# EAGLE design LCD-OLinuXino-15_6_revision_D (EAGLE 4.16)
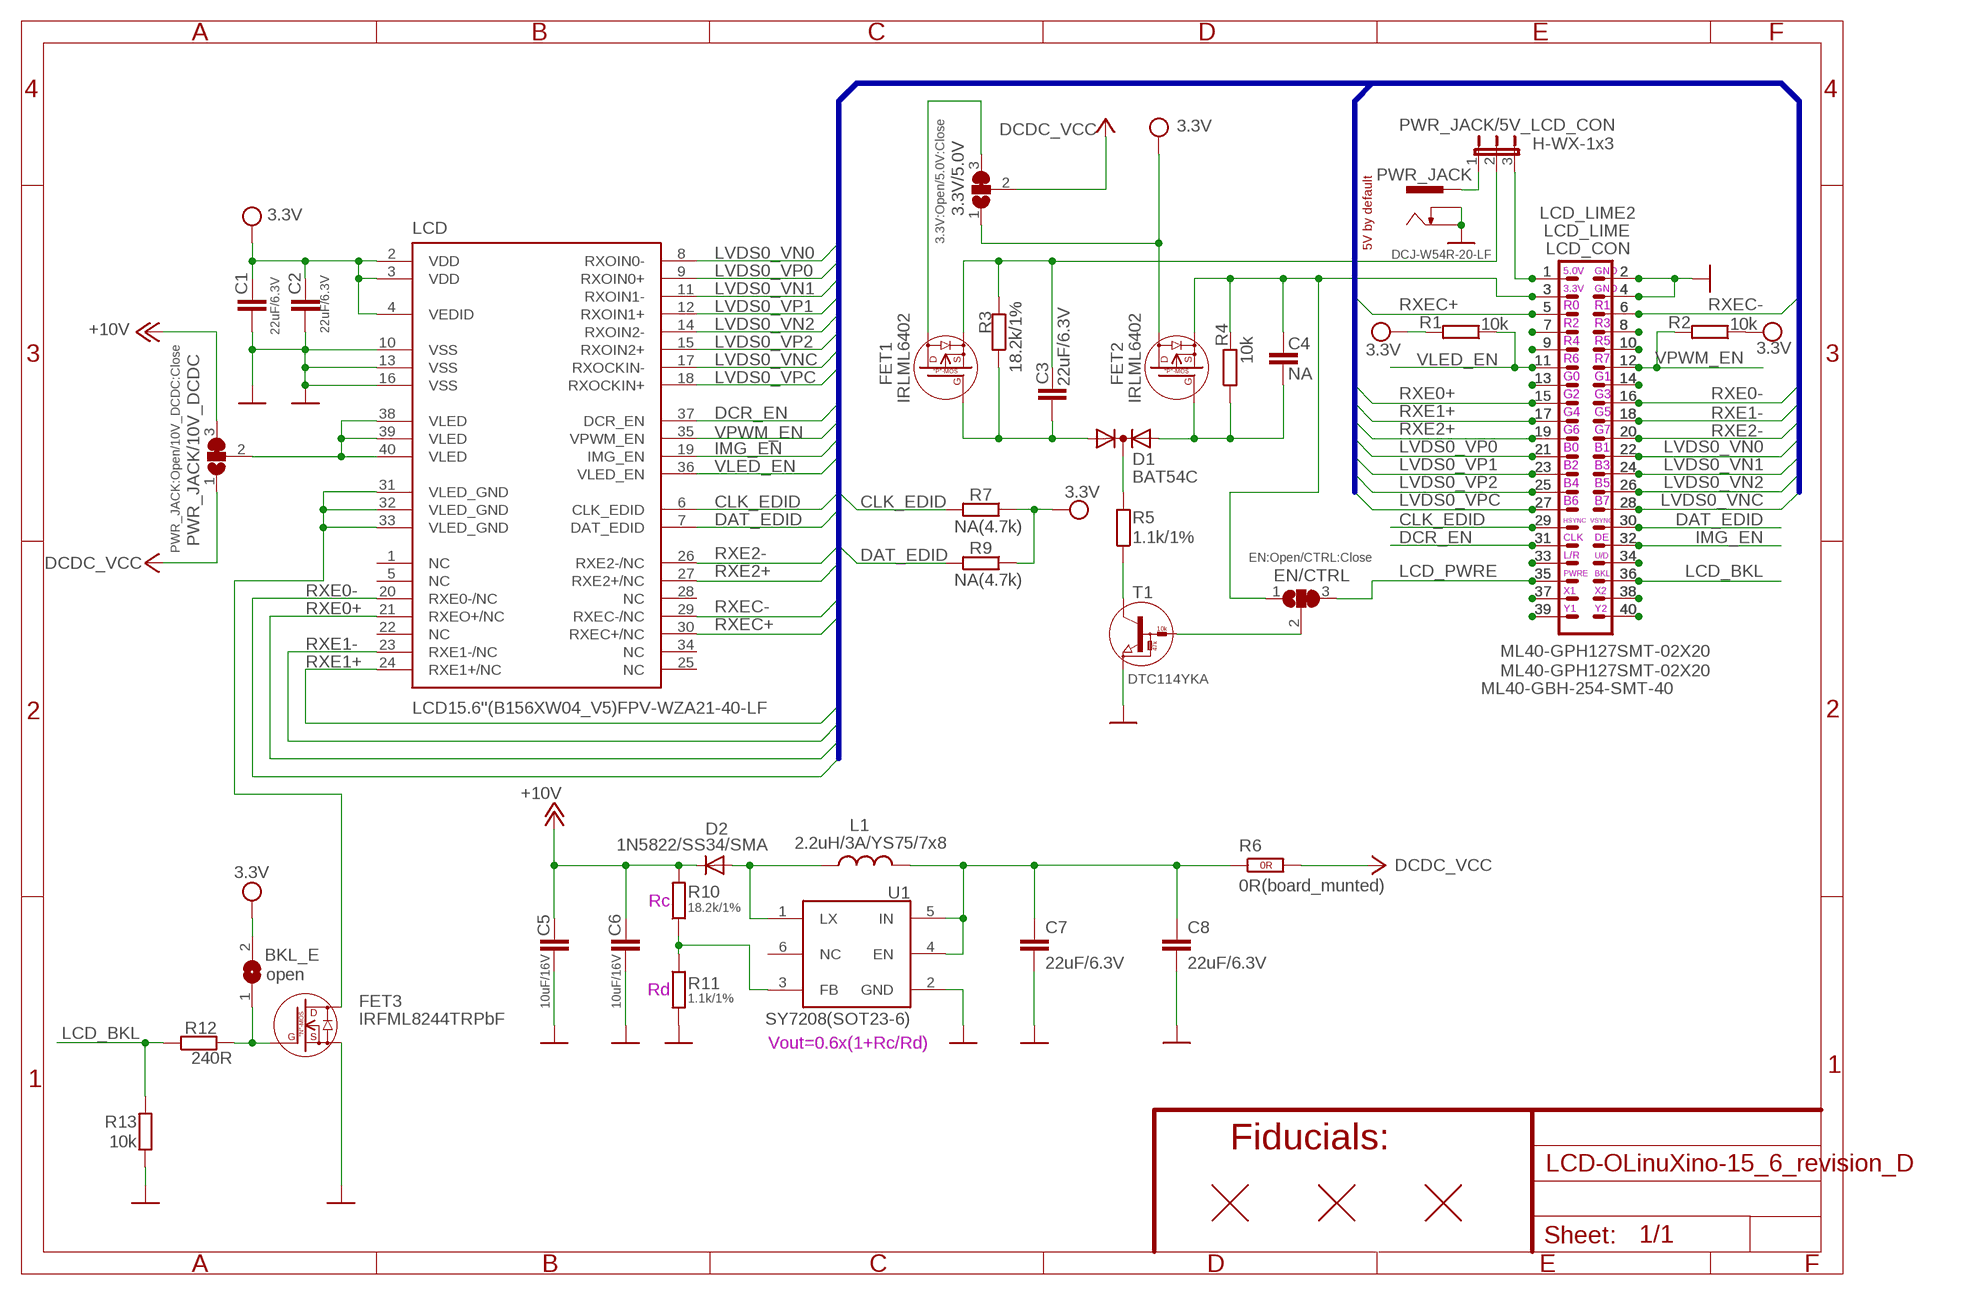
[diagram p0: schematic, sheet 1]

## Parts
3.3V/5.0V  3.3V:Open/5.0V:Close  SJ2W5  [SJ_2_SMALL_23_TIED]
BKL_E  open  SJSJ_1_THE_SMALLEST  [SJ_1_THE_SMALLEST]
C1  22uF/6.3V  C-EUC0603_DWS  [C0603_DWS]
C2  22uF/6.3V  C-EUC0603_DWS  [C0603_DWS]
C3  22uF/6.3V  C-EUC0805_5MIL_DWS  [C0805_5MIL_DWS]
C4  NA  C-EUC0603_DWS  [C0603_DWS]
C5  10uF/16V  C-EUC0805_5MIL_DWS  [C0805_5MIL_DWS]
C6  10uF/16V  C-EUC0805_5MIL_DWS  [C0805_5MIL_DWS]
C7  22uF/6.3V  C-EUC0805_5MIL_DWS  [C0805_5MIL_DWS]
C8  22uF/6.3V  C-EUC0805_5MIL_DWS  [C0805_5MIL_DWS]
D1  BAT54C  DIODE_AC-CA_  [SOT23C]
D2  1N5822/SS34/SMA  D-MLL-41  [MELF-MLL41]
EN/CTRL  EN:Open/CTRL:Close  SJ2W5  [SJ_2_SMALL_23_TIED]
FET1  IRLML6402  P-MOS+DIODIRLML6402  [SOT23]
FET2  IRLML6402  P-MOS+DIODIRLML6402  [SOT23]
FET3  IRFML8244TRPbF  N-MOS+DIODBSS138(SOT23-3)  [SOT23]
L1  2.2uH/3A/YS75/7x8  LLQH88PN100M38  [8X8MM_3131]
LCD  LCD15.6''(B156XW04_V5)FPV-WZA21-40-LF  [LCD_15.6'']
LCD_CON  ML40-GBH-254-SMT-40  [ML40-MALE(GBH-254-SMT-40)]
LCD_LIME  ML40-GPH127SMT-02X20  ML40YA-V36P-2X20-LF  [YA-V36P-2X20-LF]
LCD_LIME2  ML40-GPH127SMT-02X20  ML40-GPH127SMT-02X20(PA-V16X-2X20-LF)  [GPH127SMT-02X20(PA-V16X-2X20-LF)]
PWR_JACK  DCJ-W54R-20-LF  PWR-JAKDCJ-W  [PWR-JACK-SMD]
PWR_JACK/5V_LCD_CON  H-WX-1x3  JP2EHN1X3-SMD  [HN1X3-SMD]
PWR_JACK/10V_DCDC  PWR_JACK:Open/10V_DCDC:Close  SJ2W3  [SJ_2_SMALL]
R1  10k  R-EU_R0603_5MIL_DWS  [R0603_5MIL_DWS]
R2  10k  R-EU_R0603_5MIL_DWS  [R0603_5MIL_DWS]
R3  18.2k/1%  R-EU_R0603_5MIL_DWS  [R0603_5MIL_DWS]
R4  10k  R-EU_R0603_5MIL_DWS  [R0603_5MIL_DWS]
R5  1.1k/1%  R-EU_R0603_5MIL_DWS  [R0603_5MIL_DWS]
R6  0R(board_munted)  R_0R0R(NA)  [0603_0R]
R7  NA(4.7k)  R-EU_R0603_5MIL_DWS  [R0603_5MIL_DWS]
R9  NA(4.7k)  R-EU_R0603_5MIL_DWS  [R0603_5MIL_DWS]
R10  18.2k/1%  R-EU_R0603_5MIL_DWS  [R0603_5MIL_DWS]
R11  1.1k/1%  R-EU_R0603_5MIL_DWS  [R0603_5MIL_DWS]
R12  240R  R-EU_R0603_5MIL_DWS  [R0603_5MIL_DWS]
R13  10k  R-EU_R0603_5MIL_DWS  [R0603_5MIL_DWS]
T1  DTC114YKA  DIGITAL_TRANSISTORS-NPNDTC114YKA  [SOT-23]
U1  SY7208(SOT23-6)  SY7208  [SOT23-6]
U$1  FIDUCIAL  [FIDUCIAL-1X3]
U$2  FIDUCIAL  [FIDUCIAL-1X3]
U$3  FIDUCIAL  [FIDUCIAL-1X3]

## Nets
3.3VDC [pwr]: C4.1 EN/CTRL.1 FET2.2(S) LCD_CON.3 LCD_LIME2.3 LCD_LIME.3 R4.2
5VDC: C3.1 FET1.2(S) PWR_JACK/5V_LCD_CON.2 R3.2
+5V: 3.3V/5.0V.2 PWR_JACK/10V_DCDC.1 R6.2(1.2) ; supply symbol labelled DCDC_VCC
+12V [pwr]: C5.1 C6.1 D2.1(C) PWR_JACK/10V_DCDC.3 R10.2 ; supply symbol labelled +10V
CLK_EDID: LCD.6(CLK_EDID) LCD_CON.29 LCD_LIME2.29 LCD_LIME.29 R7.2
DAT_EDID: LCD.7(DAT_EDID) LCD_CON.30 LCD_LIME2.30 LCD_LIME.30 R9.2
DCR_EN: LCD.37(DCR_EN) LCD_CON.31 LCD_LIME2.31 LCD_LIME.31
GND [pwr]: C1.2 C2.2 C5.2 C6.2 C7.2 C8.2 FET3.2(S) LCD.10(VSS) LCD.13(VSS) LCD.16(VSS) LCD_CON.2 LCD_CON.4 LCD_LIME2.2 LCD_LIME2.4 LCD_LIME.2 LCD_LIME.4 PWR_JACK.2(-) PWR_JACK.3(--) R11.2 R13.1 T1.2(E) U1.2(GND)
IMG_EN: LCD.19(IMG_EN) LCD_CON.32 LCD_LIME2.32 LCD_LIME.32
LCD_BKL: LCD_CON.36 LCD_LIME2.36 LCD_LIME.36 R12.1 R13.2
LCD_PWRE: EN/CTRL.3 LCD_CON.35 LCD_LIME2.35 LCD_LIME.35
LVDS0_VN0: LCD.8(RXOIN0-) LCD_CON.22 LCD_LIME2.22 LCD_LIME.22
LVDS0_VN1: LCD.11(RXOIN1-) LCD_CON.24 LCD_LIME2.24 LCD_LIME.24
LVDS0_VN2: LCD.14(RXOIN2-) LCD_CON.26 LCD_LIME2.26 LCD_LIME.26
LVDS0_VNC: LCD.17(RXOCKIN-) LCD_CON.28 LCD_LIME2.28 LCD_LIME.28
LVDS0_VP0: LCD.9(RXOIN0+) LCD_CON.21 LCD_LIME2.21 LCD_LIME.21
LVDS0_VP1: LCD.12(RXOIN1+) LCD_CON.23 LCD_LIME2.23 LCD_LIME.23
LVDS0_VP2: LCD.15(RXOIN2+) LCD_CON.25 LCD_LIME2.25 LCD_LIME.25
LVDS0_VPC: LCD.18(RXOCKIN+) LCD_CON.27 LCD_LIME2.27 LCD_LIME.27
N$1: 3.3V/5.0V.3 FET1.3(D)
N$2 [pwr]: FET3.3(D) LCD.31(VLED_GND) LCD.32(VLED_GND) LCD.33(VLED_GND)
N$3 [pwr]: LCD.38(VLED) LCD.39(VLED) LCD.40(VLED) PWR_JACK/10V_DCDC.2
N$4: BKL_E.1 FET3.1(G) R12.2
N$5: LCD_CON.7 LCD_LIME2.7 LCD_LIME.7
N$6: LCD_CON.9 LCD_LIME2.9 LCD_LIME.9
N$7: LCD_CON.13 LCD_LIME2.13 LCD_LIME.13
N$8: C4.2 D1.1(A1) FET2.1(G) R4.1
N$9: C3.2 D1.2(A2) FET1.1(G) R3.1
N$10: LCD_CON.33 LCD_LIME2.33 LCD_LIME.33
N$11: R5.1 T1.3(C)
N$12: LCD_CON.37 LCD_LIME2.37 LCD_LIME.37
N$13: LCD_CON.39 LCD_LIME2.39 LCD_LIME.39
N$14: LCD_CON.8 LCD_LIME2.8 LCD_LIME.8
N$15: LCD_CON.10 LCD_LIME2.10 LCD_LIME.10
N$16: EN/CTRL.2 T1.1(B)
N$17: LCD_CON.14 LCD_LIME2.14 LCD_LIME.14
N$18: LCD_CON.34 LCD_LIME2.34 LCD_LIME.34
N$19: D1.3(K) R5.2
N$20: LCD_CON.1 LCD_LIME2.1 LCD_LIME.1 PWR_JACK/5V_LCD_CON.3
N$21: LCD_CON.38 LCD_LIME2.38 LCD_LIME.38
N$22 [pwr]: PWR_JACK.1(+) PWR_JACK/5V_LCD_CON.1
N$23: LCD_CON.40 LCD_LIME2.40 LCD_LIME.40
N$24: C7.1 C8.1 L1.2 R6.1(1.1) U1.4(EN) U1.5(IN)
N$123: D2.2(A) L1.1 U1.1(LX)
N$126: R10.1 R11.1 U1.3(FB)
RXE0+: LCD.21(RXEO+/NC) LCD_CON.15 LCD_LIME2.15 LCD_LIME.15
RXE0-: LCD.20(RXE0-/NC) LCD_CON.16 LCD_LIME2.16 LCD_LIME.16
RXE1+: LCD.24(RXE1+/NC) LCD_CON.17 LCD_LIME2.17 LCD_LIME.17
RXE1-: LCD.23(RXE1-/NC) LCD_CON.18 LCD_LIME2.18 LCD_LIME.18
RXE2+: LCD.27(RXE2+/NC) LCD_CON.19 LCD_LIME2.19 LCD_LIME.19
RXE2-: LCD.26(RXE2-/NC) LCD_CON.20 LCD_LIME2.20 LCD_LIME.20
RXEC+: LCD.30(RXEC+/NC) LCD_CON.5 LCD_LIME2.5 LCD_LIME.5
RXEC-: LCD.29(RXEC-/NC) LCD_CON.6 LCD_LIME2.6 LCD_LIME.6
VCC [pwr]: 3.3V/5.0V.1 BKL_E.2 C1.1 C2.1 FET2.3(D) LCD.2(VDD) LCD.3(VDD) LCD.4(VEDID) R1.2 R2.1 R7.1 R9.1 ; supply symbol labelled 3.3V
VLED_EN: LCD.36(VLED_EN) LCD_CON.11 LCD_LIME2.11 LCD_LIME.11 R1.1
VPWM_EN: LCD.35(VPWM_EN) LCD_CON.12 LCD_LIME2.12 LCD_LIME.12 R2.2
Unconnected: LCD.1(NC) LCD.5(NC) LCD.22(NC) LCD.25(NC) LCD.28(NC) LCD.34(NC) U1.6(NC)

## Buses
LVDS0_VP[0..2],LVDS0_VN[0..2],LVDS0_VPC,LVDS0_VNC,CLK_EDID,DAT_EDID,DCR_EN,IMG_EN,VPWM_EN,VLED_EN,RXE0-,RXE0+,RXE1-,RXE1+,RXE2-,RXE2+,RXEC-,RXEC+

## Notes on the sheet
- 5V by default
- 5.0V | GND
- 3.3V | GND
- R0 | R1
- R2 | R3
- R4 | R5
- R6 | R7
- G0 | G1
- G2 | G3
- G4 | G5
- G6 | G7
- B0 | B1
- B2 | B3
- B4 | B5
- B6 | B7
- HSYNC | VSYNC
- CLK | DE
- L/R | U/D
- PWRE | BKL
- X1 | X2
- Y1 | Y2
- Rc
- Rd
- Vout=0.6x(1+Rc/Rd)
- Fiducials:

## Library data of the parts
3.3V/5.0V EN/CTRL PWR_JACK/10V_DCDC = jumper:SJ2W: SMD solder JUMPER
BKL_E = jumper:SJ: SMD solder JUMPER
C1-C8 = rcl:C-EU: CAPACITOR, European symbol
D1 = semicon-smd-ipc:DIODE_AC-CA_: DUAL DIODE
D2 = semicon-smd-ipc:D-: DIODE unfilled
FET1 FET2 = Penko:P-MOS+DIOD
FET3 = Penko:N-MOS+DIOD
L1 = OLIMEX_DISCRET:L
LCD = olimex_lcd:LCD15.6''(B156XW04_V5): LCD B156XW04 V5 LCD type: Color Active Matrix Liquid Cristal Display composed of a TFT LCD panel, a driver circuit, and LED backlight system Screen format: 16x9 HD(1366x768 pixels) Number of colors: 262K colors(RGB 6-bits data driver) Pixel Pitch: 0.252x0.252mm Pixel Format: RGB Vertical Stripe Display Mode: Normally White White Luminance (Iled=20mA): 200cd/m2 typical, 170cd/m2 minimum Response Time: 8ms Nominal Input Voltage VDD: +3.3V Power Consumption: 3.4W Physical size: 360x224.3x3.8 Electrical interface: 1 channel LVDS
LCD_CON LCD_LIME LCD_LIME2 = con-harting-ml:ML40: HARTING
PWR_JACK = gogo:PWR-JAK
PWR_JACK/5V_LCD_CON = jumper:JP2E: JUMPER
R1-R5 R7 R9-R13 = rcl:R-EU_: RESISTOR, European symbol
R6 = OLIMEX_DISCRET:R_0R
T1 = OLIMEX_DISCRET:DIGITAL_TRANSISTORS-NPN: DTC114YKA Digital Transistor - NPN
U1 = OLIMEX_IC:SY7208
U$1-U$3 = SparkFunEagle-6-6-07:FIDUCIAL: Fiducial Alignment Points Various fiducial points for machine vision alignment.

## Net classes
1 pwr: width 0.254 mm, drill 0.241 mm, clearance 0.254 mm

## Board
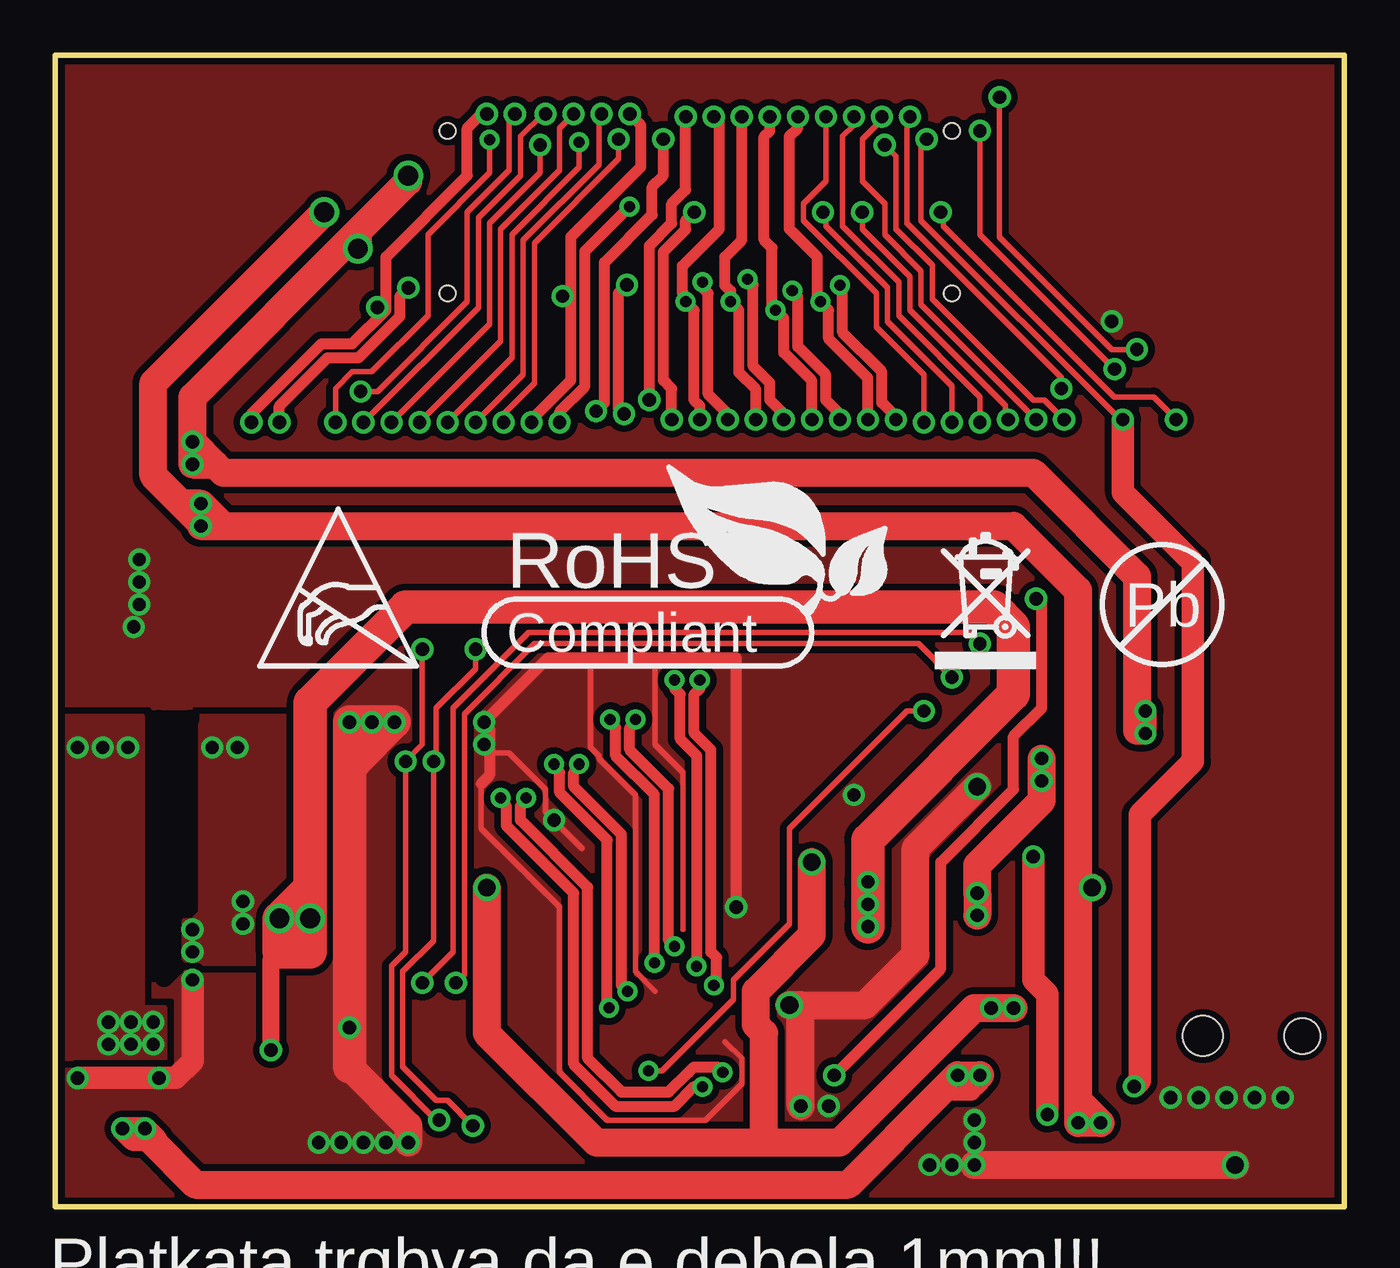
[diagram p1: board, top side]
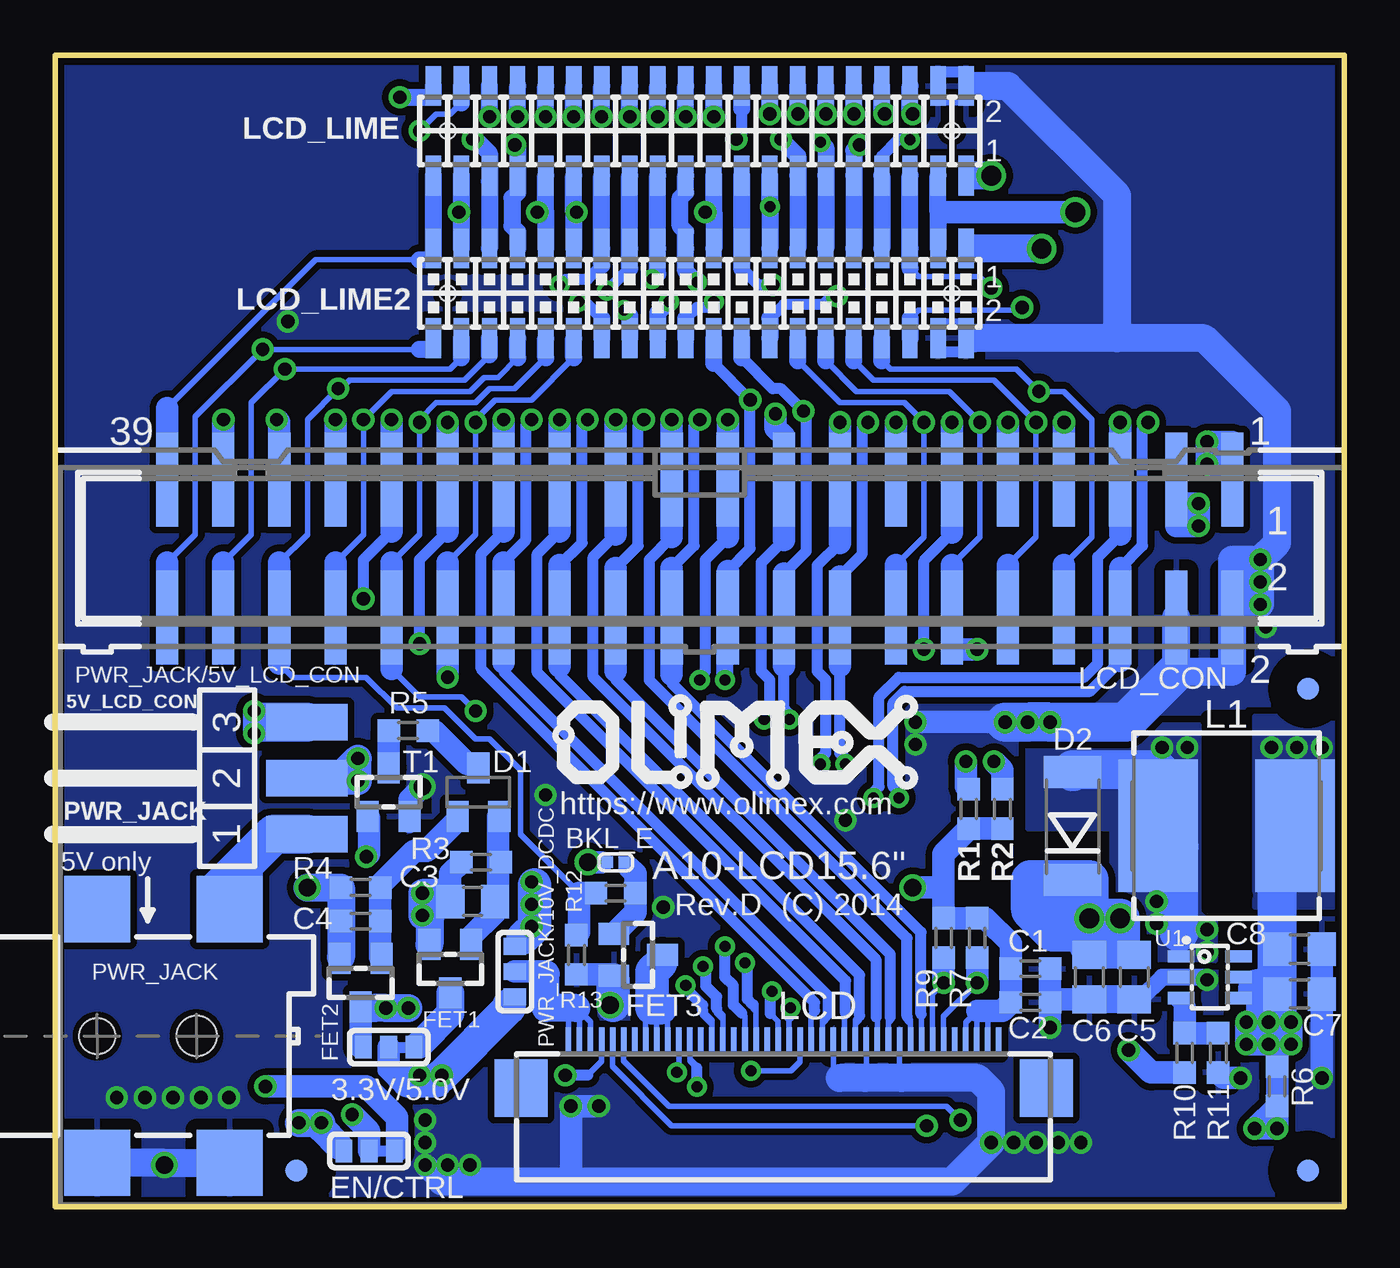
[diagram p2: board, bottom side, seen from below]

Size 58.42 x 52.2 mm. Coordinates in mm from the lower left corner, seen from the top.
Outline: 0,52.2 0,0 58.42,0 58.42,52.2 0,52.2
Copper layers (1+16): Top 0.035mm / dielectric 1mm / Bottom 0.035mm
Design rules "default": minimum track width 9.5mil, minimum drill 0.5mm, track to track 5mil, track to pad 8mil, pad to pad 8mil, via to via 8mil, smd to smd 1mil, copper to edge 10mil, drill to drill 8mil, minimum pad ring 8mil, minimum via ring 8mil, stop-mask expansion 4mil, vias tented up to drill 40mil, thermal gap 20mil
tRestrict: 3 lines
bRestrict: 2 lines

### Footprints (pad centres in the part's own frame; a part is rotated, then mirrored left to right if it is on the bottom)
SJ_2_SMALL_23_TIED = smd 0.762 x 1.016: 1 -1.143,0; 2 0,0; 3 1.143,0
SJ_1_THE_SMALLEST = smd 0.508 x 0.508: 1 -0.381,0; 2 0.381,0
C0603_DWS = smd 1.016 x 1.016: 1 -0.889,0; 2 0.889,0
C0805_5MIL_DWS = smd 1.27 x 1.524: 1 -1.016,0; 2 1.016,0
SOT23C = smd 1 x 1.4: 1 -0.95,-1.1; 2 0.95,-1.1; 3 0,1.1
MELF-MLL41 = smd 1.45 x 2.6: 1 -2.445,0; 2 2.445,0
SOT23 = smd 1 x 1.4: 1 -0.95,-1.1; 2 0.95,-1.1; 3 0,1.1
8X8MM_3131 = smd 3.6 x 6: 1 -3.1,0; 2 3.1,0
LCD_15.6'' = smd 0.25 x 1.3 bottom: 1 -67.54,31.89; 2 -67.04,31.89; 3 -66.54,31.89; 4 -66.04,31.89; 5 -65.54,31.89; 6 -65.04,31.89; 7 -64.54,31.89; 8 -64.04,31.89; 9 -63.54,31.89; 10 -63.04,31.89; 11 -62.54,31.89; 12 -62.04,31.89; 13 -61.54,31.89; 14 -61.04,31.89; 15 -60.54,31.89; 16 -60.04,31.89; 17 -59.54,31.89; 18 -59.04,31.89; 19 -58.54,31.89; 20 -58.04,31.89; 21 -57.54,31.89; 22 -57.04,31.89; 23 -56.54,31.89; 24 -56.04,31.89; 25 -55.54,31.89; 26 -55.04,31.89; 27 -54.54,31.89; 28 -54.04,31.89; 29 -53.54,31.89; 30 -53.04,31.89; 31 -52.54,31.89; 32 -52.04,31.89; 33 -51.54,31.89; 34 -51.04,31.89; 35 -50.54,31.89; 36 -50.04,31.89; 37 -49.54,31.89; 38 -49.04,31.89; 39 -48.54,31.89; 40 -48.04,31.89 | smd 2.4 x 2.6 bottom: P1 -69.69,29.79; P2 -45.89,29.79
ML40-MALE(GBH-254-SMT-40) = smd 1 x 4.25: 1 -24.13,-3.125; 2 -24.13,3.125; 3 -21.59,-3.125; 4 -21.59,3.125; 5 -19.05,-3.125; 6 -19.05,3.125; 7 -16.51,-3.125; 8 -16.51,3.125; 9 -13.97,-3.125; 10 -13.97,3.125; 11 -11.43,-3.125; 12 -11.43,3.125; 13 -8.89,-3.125; 14 -8.89,3.125; 15 -6.35,-3.125; 16 -6.35,3.125; 17 -3.81,-3.125; 18 -3.81,3.125; 19 -1.27,-3.125; 20 -1.27,3.125; 21 1.27,-3.125; 22 1.27,3.125; 23 3.81,-3.125; 24 3.81,3.125; 25 6.35,-3.125; 26 6.35,3.125; 27 8.89,-3.125; 28 8.89,3.125; 29 11.43,-3.125; 30 11.43,3.125; 31 13.97,-3.125; 32 13.97,3.125; 33 16.51,-3.125; 34 16.51,3.125; 35 19.05,-3.125; 36 19.05,3.125; 37 21.59,-3.125; 38 21.59,3.125; 39 24.13,-3.125; 40 24.13,3.125
YA-V36P-2X20-LF = smd 0.7 x 1.8: 1 -12.065,2.032; 2 -12.065,-2.032; 3 -10.795,2.032; 4 -10.795,-2.032; 5 -9.525,2.032; 6 -9.525,-2.032; 7 -8.255,2.032; 8 -8.255,-2.032; 9 -6.985,2.032; 10 -6.985,-2.032; 11 -5.715,2.032; 12 -5.715,-2.032; 13 -4.445,2.032; 14 -4.445,-2.032; 15 -3.175,2.032; 16 -3.175,-2.032; 17 -1.905,2.032; 18 -1.905,-2.032; 19 -0.635,2.032; 20 -0.635,-2.032; 21 0.635,2.032; 22 0.635,-2.032; 23 1.905,2.032; 24 1.905,-2.032; 25 3.175,2.032; 26 3.175,-2.032; 27 4.445,2.032; 28 4.445,-2.032; 29 5.715,2.032; 30 5.715,-2.032; 31 6.985,2.032; 32 6.985,-2.032; 33 8.255,2.032; 34 8.255,-2.032; 35 9.525,2.032; 36 9.525,-2.032; 37 10.795,2.032; 38 10.795,-2.032; 39 12.065,2.032; 40 12.065,-2.032 | hole 0.7: -11.43,0; 11.43,0
GPH127SMT-02X20(PA-V16X-2X20-LF) = smd 0.7 x 1.8: 1 -12.065,-2.032; 2 -12.065,2.032; 3 -10.795,-2.032; 4 -10.795,2.032; 5 -9.525,-2.032; 6 -9.525,2.032; 7 -8.255,-2.032; 8 -8.255,2.032; 9 -6.985,-2.032; 10 -6.985,2.032; 11 -5.715,-2.032; 12 -5.715,2.032; 13 -4.445,-2.032; 14 -4.445,2.032; 15 -3.175,-2.032; 16 -3.175,2.032; 17 -1.905,-2.032; 18 -1.905,2.032; 19 -0.635,-2.032; 20 -0.635,2.032; 21 0.635,-2.032; 22 0.635,2.032; 23 1.905,-2.032; 24 1.905,2.032; 25 3.175,-2.032; 26 3.175,2.032; 27 4.445,-2.032; 28 4.445,2.032; 29 5.715,-2.032; 30 5.715,2.032; 31 6.985,-2.032; 32 6.985,2.032; 33 8.255,-2.032; 34 8.255,2.032; 35 9.525,-2.032; 36 9.525,2.032; 37 10.795,-2.032; 38 10.795,2.032; 39 12.065,-2.032; 40 12.065,2.032 | hole 0.7: -11.43,0; 11.43,0
PWR-JACK-SMD = smd 3 x 3: 1 6,5.75; 2 0,-5.75; 3 6,-5.75; 4 0,5.75 | hole 1.6: 0,0 | hole 1.8: 4.5,0
HN1X3-SMD = smd 1.651 x 3.683: 1 -2.54,-0.229; 2 0,-0.229; 3 2.54,-0.229
SJ_2_SMALL = smd 0.762 x 1.016: 1 -1.143,0; 2 0,0; 3 1.143,0
R0603_5MIL_DWS = smd 1.016 x 1.016: 1 -0.889,0; 2 0.889,0
0603_0R = smd 1.016 x 1.016: 1 -0.889,0; 2 0.889,0
SOT-23 = smd 1 x 1.4: 1 -0.95,-1.1; 2 0.95,-1.1; 3 0,1.1
SOT23-6 = smd 0.55 x 1.2: 1 -0.95,-1.3; 2 0,-1.3; 3 0.95,-1.3; 4 0.95,1.3; 5 0,1.3; 6 -0.95,1.3
FIDUCIAL-1X3 = smd 1 x 1: 1 0,0

### Placement (x,y rotation side)
3.3V/5.0V  43.31,7.24 0 bottom
BKL_E  33.02,15.62 180 bottom
C1  14.22,10.79 0 bottom
C2  14.22,9.27 0 bottom
C3  39.5,13.84 0 bottom
C4  44.58,12.95 0 bottom
C5  9.53,10.41 270 bottom
C6  11.56,10.41 270 bottom
C7  2.03,9.65 0 bottom
C8  2.03,11.68 0 bottom
D1  39.24,18.8 0 bottom
D2  12.32,17.27 90 bottom
EN/CTRL  44.2,2.54 0 bottom
FET1  40.51,10.79 180 bottom
FET2  44.58,10.16 180 bottom
FET3  32,11.43 270 bottom
L1  5.33,17.27 0 bottom
LCD  83.2,-24.4 0 top
LCD_CON  29.21,29.84 180 bottom
LCD_LIME  29.21,48.77 180 bottom
LCD_LIME2  29.21,41.4 180 bottom
PWR_JACK  56.52,7.75 0 bottom
PWR_JACK/5V_LCD_CON  47.24,19.43 90 bottom
PWR_JACK/10V_DCDC  37.59,10.67 90 bottom
R1  17.02,18.03 270 bottom
R2  15.49,18.03 90 bottom
R3  39.12,15.62 180 bottom
R4  44.58,14.48 180 bottom
R5  42.42,21.59 0 bottom
R6  3.05,5.46 270 bottom
R7  16.64,12.19 270 bottom
R9  18.16,12.19 270 bottom
R10  7.24,6.99 270 bottom
R11  5.71,6.99 270 bottom
R12  33.02,14.22 0 bottom
R13  34.8,11.43 90 bottom
T1  43.31,18.8 0 bottom
U1  6.1,10.41 270 bottom
U$1  47.5,1.65 270 bottom
U$2  1.65,1.65 270 bottom
U$3  1.65,23.5 270 bottom
U$5  [ROHS]  20.45,25.15 0 top
U$6  [PB]  50.16,27.3 0 top
U$8  [OLIMEX1_V]  18.16,18.8 0 bottom
U$10  [ESD_SYMBOL]  9.27,24.51 0 top
U$11  [RECYCLE_BIN1/8]  39.88,24.38 0 top

### Tracks (layer width: path | path; a pad name or v marks a point on that pad's centre or on a via)
3.3VDC  (via drill 0.6, 0.8, 0.9)
  Top 1.27: 7.62,30.86 v6.6,31.88 | v6.6,30.86 7.62,30.86 | v6.6,30.86 v6.6,31.88 | 7.62,30.86 43.43,30.86 46.35,27.94 46.35,14.48 | 46.35,14.48 46.35,4.83 | 46.35,4.83 v47.37,3.81 v46.35,3.81 46.35,4.83 | 46.35,14.48 v46.99,14.48 | v6.6,31.88 5.71,31.88 | 5.71,31.88 4.45,33.15 4.45,37.34 v12.19,45.09 | v6.6,30.86 6.6,30.99 5.71,31.88
  Bottom 0.508: 18.16,45.09 18.41,45.09
  Bottom 0.762: 45.59,2.79 EN/CTRL.1 | LCD_LIME2.3 18.41,45.09 LCD_LIME.3
  Bottom 1.016: 7.62,31.88 LCD_CON.3 | 7.62,31.88 v6.6,31.88 v6.6,30.86 7.62,30.86 7.62,31.88 | 45.47,11.32 FET2.2 | v12.19,45.09 18.16,45.09
  Bottom 1.27: 45.47,11.32 C4.1 R4.2 v46.99,14.48 | 45.59,2.79 46.35,3.56 v46.35,3.81 v47.37,3.81
5VDC  (via drill 0.6)
  Top 1.27: v44.7,20.32 v44.7,19.3 44.7,18.41 41.78,15.49 v41.78,14.22 v41.78,13.21
  Bottom 1.016: 40.51,14.22 40.51,15.11 R3.2
  Bottom 1.27: 45.72,19.3 v44.7,19.3 v44.7,20.32 45.72,19.3 | 45.72,19.3 46.89,19.3 PWR_JACK/5V_LCD_CON.2 | 41.46,13.21 FET1.2 | 41.46,13.21 41.4,13.21 | 41.46,13.21 v41.78,13.21 v41.78,14.22 40.51,14.22 C3.1
+5V  (via drill 0.6)
  Top 0.762: v41.91,5.97 41.91,5.59 41.53,5.21 40.13,5.21
  Top 1.016: v4.06,3.56 4.57,3.05 4.32,3.05 3.56,3.05 v3.05,3.56 v4.06,3.56
  Top 1.27: v41.91,5.97 v40.89,5.97 40.13,5.21 35.94,1.02 6.35,1.02 4.32,3.05
  Bottom 0.508: PWR_JACK/10V_DCDC.1 37.59,9.4 37.85,9.14 | v41.91,5.97 41.91,5.71
  Bottom 0.762: 42.55,5.71 42.95,5.71 43.43,6.2 43.43,7.11 3.3V/5.0V.2
  Bottom 1.016: 42.42,5.71 42.55,5.71 42.67,5.71 43.31,6.35 3.3V/5.0V.2 | R6.2 v3.05,3.56 v4.06,3.56 R6.2
  Bottom 1.524: 37.85,9.14 37.85,9.02 v40.89,5.97 41.15,5.71 41.91,5.71 42.42,5.71
+12V  (via drill 0.6, 0.9)
  Top 0.762: v9.78,7.11 9.78,11.18 10.16,11.56
  Top 1.524: v11.56,13.08 11.56,14.48 | v10.16,13.08 v11.56,13.08 | v10.16,13.08 11.56,14.48 | 11.56,14.48 11.56,22.86 15.88,27.18 42.55,27.18 43.43,26.29 43.43,23.24 36.83,16.64 v36.83,14.73 v36.83,13.72 v36.83,12.7 | v11.56,13.08 11.56,11.56 10.16,11.56 v10.16,13.08
  Bottom 0.508: 37.21,12.19 PWR_JACK/10V_DCDC.3
  Bottom 1.016: R10.2 8.76,6.1 v9.78,7.11 | v36.83,14.73 36.7,14.61
  Bottom 1.27: 10.16,11.43 C5.1 | 10.16,11.43 C6.1 11.56,11.81 | 10.16,12.06 10.16,11.43
  Bottom 1.524: 37.21,12.19 36.7,12.7 36.7,14.61
  Bottom 1.778: 11.56,12.45 11.56,11.81 | v11.56,13.08 11.56,12.45 | v11.56,13.08 v10.16,13.08 10.16,12.06 | v11.56,13.08 11.56,14.83 D2.1 13.21,14.83 | 13.21,12.45 13.21,14.83 | 11.56,12.45 13.21,12.45 | 13.21,12.45 14.22,13.46 14.22,14.83 13.21,14.83
CLK_EDID  (via drill 0.6)
  Top 0.254: v16.64,10.16 18.03,11.56 18.03,22.61 21.46,26.04 41.4,26.04 v41.91,25.53 | v40.64,35.56 40.64,37.21 37.72,40.13 37.72,41.66 34.92,44.45 34.92,44.96 v34.8,45.09
  Bottom 0.254: LCD.6 18.16,8.64 v16.64,10.16
  Bottom 0.508: v41.91,25.53 41.91,29.34 40.64,30.61
  Bottom 0.762: 34.92,45.09 LCD_LIME2.29 | v34.8,45.09 34.92,45.09 | 34.92,45.09 LCD_LIME.29
  Bottom 1.016: 40.64,30.61 LCD_CON.29 v40.64,35.56 | v16.64,10.16 R7.2
DAT_EDID  (via drill 0.6)
  Top 0.254: v18.16,10.16 18.54,10.54 18.54,22.35 21.72,25.53 39.12,25.53 v40.64,24 | v39.37,35.56 39.37,37.72 37.21,39.88 37.21,41.4 33.91,44.7 33.91,45.47 34.92,46.48 v34.92,49.4
  Bottom 0.254: LCD.7 18.66,9.66 v18.16,10.16 | 40.64,29.21 39.37,30.48 v39.37,35.56 39.37,35.69 38.48,36.58 36.83,36.58 34.92,38.48
  Bottom 0.762: 34.92,38.48 LCD_LIME2.30 | v34.92,49.4 LCD_LIME.30
  Bottom 1.016: v40.64,24 LCD_CON.30 40.64,29.21 | v18.16,10.16 R9.2
DCR_EN  (via drill 0.6)
  Top 0.254: v43.18,35.69 43.05,35.81 43.05,36.32 38.73,40.64 38.73,42.16 36.58,44.32 v36.58,45.09
  Top 0.508: v35.31,5.97 40.13,10.79 40.13,15.62 43.43,18.92 43.43,21.34 44.7,22.61 44.7,27.3 v44.45,27.56
  Bottom 0.254: LCD.37 33.66,6.6 34.29,5.97
  Bottom 0.508: v44.45,27.56 44.45,29.34 43.18,30.61 | 34.29,5.97 v35.31,5.97
  Bottom 0.762: 36.2,45.09 LCD_LIME2.31 | 36.2,45.09 LCD_LIME.31 | v36.58,45.09 36.2,45.09
  Bottom 1.016: 43.18,30.61 LCD_CON.31 v43.18,35.69
GND  (via drill 0.6, 0.8)
  Top 0.254: 19.3,19.18 19.3,17.14 22.86,13.59 22.86,6.1 25.02,3.94 29.46,3.94 31.11,5.59 31.11,6.73 30.35,7.49 | 24.26,24.89 24.26,20.83 24.64,20.45 24.64,20.32 26.29,18.67 26.29,10.67 27.18,9.78 | 19.68,20.57 20.57,20.57 22.23,18.92 22.23,17.91 v22.61,17.53 23.88,16.26 | 27.18,24.89 27.18,20.95 28.45,19.68 28.45,12.57
  Top 0.508: 19.3,19.18 19.68,19.56 19.68,20.57 19.68,21.72 v19.43,21.97 22.35,24.89 24.26,24.89 27.18,24.89 30.86,24.89 v30.86,13.59
  Top 1.016: v6.22,10.29 6.22,6.6 5.46,5.84 v4.7,5.84 v1.02,5.84
  Top 1.27: 13.34,6.35 16,3.68 v16,2.92 | v41.78,19.05 38.99,16.26 38.99,11.43 36.7,9.14 33.78,9.14 | 33.78,9.14 v33.27,9.14 | v41.66,1.91 v53.47,1.91 | v33.78,4.57 33.78,9.14
  Top 1.524: 13.34,6.35 v13.34,8.13 13.34,20.19 | 13.34,20.19 v13.34,21.97 v14.35,21.97 v15.37,21.97 13.59,20.19 13.34,20.19
  Bottom 0.254: 20.07,5.84 20.07,5.97 20.16,6.06 LCD.10 | LCD.13 21.66,5.9 21.72,5.84 | LCD.16 23.16,6.14 22.86,5.84
  Bottom 0.508: LCD_LIME2.2 17.14,38.73 18.41,38.73 LCD_LIME2.4 18.41,40.01 17.14,40.01 LCD_LIME2.2 | 16.76,39.37 LCD_LIME2.2 | LCD_LIME.2 17.14,51.44 18.41,51.44 LCD_LIME.4 18.41,50.16 17.14,50.16 LCD_LIME.2 | 16.76,50.8 LCD_LIME.2
  Bottom 0.762: C5.2 9.27,9.4 8.26,10.41 U1.2 6.35,10.41 v6.22,10.29
  Bottom 1.016: 40.89,1.14 v41.66,1.91 | 42.36,17.46 T1.2 42.36,18.48 v41.78,19.05 | v53.47,1.91 53.47,2 | v33.78,4.57 v35.05,4.57 35.05,1.14 | v13.34,8.13 C2.2 13.34,9.4 | C8.2 C7.2 v1.02,5.84 | 13.34,9.4 C1.2 | C6.2 13.34,9.4 | v15.37,21.97 v19.43,21.97 | v4.7,5.84 5.46,5.84 R11.2 | R13.1 33.16,10.54 FET3.2 33.15,10.48 33.15,10.29
  Bottom 1.27: PWR_JACK.3 53.47,2 PWR_JACK.2 | 40.89,1.14 35.05,1.14 17.78,1.14 v16,2.92 16,5.21 16.64,5.84 20.07,5.84 21.72,5.84 22.86,5.84 | LCD_CON.4 7.62,24.26 5.08,24.26 LCD_CON.2 5.08,27.3 | C5.2 C6.2 | v33.27,9.14 33.15,9.14 | 16.76,50.8 15.24,50.8 10.29,45.85 10.29,39.37 | 10.29,39.37 16.76,39.37 | 10.29,39.37 6.35,39.37 3.05,36.07 3.05,30.1 v3.81,29.34 | 5.08,27.3 5.08,29.34 v3.81,29.34 | v3.81,29.34 v3.81,27.3 5.08,27.3
  Bottom 1.524: 33.15,9.14 33.15,10.29
  Bottom 1.778: 7.62,24.26 9.91,21.97 v13.34,21.97 v14.35,21.97 v15.37,21.97
  other vias: 50.55,4.95 51.82,4.95 53.09,4.95 54.36,4.95 55.63,4.95 40.64,1.91 41.66,2.92 14.99,2.92 13.97,2.92 12.95,2.92 3.81,28.32 41.66,3.94 39.62,1.91 11.94,2.92 19.43,20.95 36.2,18.67 47.88,40.13 3.56,26.29
  pour Top (isolate 0.305, rank 2): 68.45,60.96 68.45,-5.08 -5.08,-5.08 -5.08,60.96
  pour Bottom (isolate 0.305, rank 3): -2.54,-2.54 64.26,-2.54 64.26,58.42 -2.54,58.42
IMG_EN  (via drill 0.5, 0.6)
  Top 0.254: v26.9,6.17 27.51,6.17 30.73,9.4 30.73,10.29 33.27,12.83 33.27,17.14 38.61,22.48 v39.37,22.48 | v41.91,35.56 41.91,36.7 38.23,40.39 38.23,41.91 35.69,44.45 35.69,48.51 36.2,49.02 v36.2,49.4
  Bottom 0.254: LCD.19 24.66,6.58 25.07,6.17 v26.9,6.17 | 43.18,24.38 41.91,23.11 40.01,23.11 v39.37,22.48 | 43.18,29.21 41.91,30.48 v41.91,35.56 41.91,35.69 41.15,36.45 39.37,36.45 38.73,37.08 37.59,37.08 36.2,38.48
  Bottom 0.762: 36.2,38.48 LCD_LIME2.32 | v36.2,49.4 LCD_LIME.32
  Bottom 1.016: 43.18,24.38 LCD_CON.32 43.18,29.21
LCD_BKL  (via drill 0.6)
  Top 0.254: v45.59,37.08 45.59,37.59 38.61,44.58 38.61,49.28 v38.73,49.4
  Bottom 0.254: 48.26,24.64 47.62,24 44.32,24 42.93,22.61 40.77,22.61 39.37,21.21 38.73,21.21 37.34,19.81 37.34,16.89 34.67,14.22 | 48.26,29.21 46.99,30.48 46.99,35.69 v45.59,37.08 45.47,37.08 45.09,37.47 39.88,37.47 38.73,38.61
  Bottom 0.762: v38.73,49.4 LCD_LIME.36 | 38.73,38.61 LCD_LIME2.36
  Bottom 1.016: 48.26,24.64 LCD_CON.36 48.26,29.21 | R13.2 34.67,12.45 34.67,14.22 R12.1
LCD_PWRE  (via drill 0.6)
  Top 0.254: v48.39,35.69 48.26,35.69 39.24,44.7 39.24,48.13 v39.5,48.39
  Top 1.016: v48.9,5.46 49.15,5.71 49.15,17.78 51.56,20.19 51.56,29.21 48.39,32.38 v48.39,35.69
  Bottom 0.508: 38.73,46.48 LCD_LIME.35
  Bottom 0.762: EN/CTRL.3 42.93,2.54 | LCD_LIME2.35 38.73,46.48 38.73,47.75 39.37,48.39 v39.5,48.39
  Bottom 1.016: 42.93,2.54 42.93,4.06 44.32,5.46 v48.9,5.46 | v48.39,35.69 48.26,35.56 LCD_CON.35
LVDS0_VN0  (via drill 0.5, 0.6)
  Top 0.508: v29.21,35.69 29.21,36.3 28.96,36.55 28.96,40.64 v28.57,41.02 28.57,41.27 28.42,41.43 28.42,42.65 30.1,44.32 30.1,49.15 v29.84,49.4
  Bottom 0.254: LCD.8 19.16,8.72 19.18,8.74
  Bottom 0.508: 30.48,24.13 30.48,23.75 19.18,12.45 19.18,8.74 | 30.48,28.96 29.46,29.97 29.46,35.43 v29.21,35.69 | v28.57,41.02 28.83,40.77 29.34,40.77 29.84,40.26
  Bottom 0.762: 29.84,40.26 LCD_LIME2.22 | v29.84,49.4 LCD_LIME.22
  Bottom 1.016: 30.48,24.13 LCD_CON.22 30.48,28.96
LVDS0_VN1  (via drill 0.5, 0.6)
  Top 0.508: v31.75,35.69 31.75,37.06 30.99,37.82 30.99,40.64 v30.61,41.02 30.61,41.5 30.35,41.76 30.35,43.05 31.11,43.81 v31.11,49.4
  Bottom 0.254: LCD.11 20.66,8.34 | 20.66,8.34 20.66,8.53 20.57,8.61 20.57,8.42 20.66,8.34
  Bottom 0.508: 20.57,8.61 20.57,11.46 33.02,23.9 33.02,24.28 | 33.02,28.96 32,29.97 32,35.43 v31.75,35.69
  Bottom 0.762: v30.61,41.02 31.11,40.51 LCD_LIME2.24 | v31.11,49.4 LCD_LIME.24
  Bottom 1.016: 33.02,24.28 LCD_CON.24 33.02,28.96
LVDS0_VN2  (via drill 0.5, 0.6)
  Top 0.508: v34.29,35.69 34.29,37.44 33.02,38.71 33.02,40.26 v32.64,40.64 32.49,40.79 32.49,43.46 32.13,43.81 32.13,48.51 32.38,48.77 v32.38,49.4
  Bottom 0.254: LCD.14 22.16,8.29 | 22.16,8.29 22.16,8.47 21.97,8.66 21.97,8.48 22.16,8.29
  Bottom 0.508: 35.56,24.49 35.56,24.11 21.97,10.52 21.97,8.66 | 35.56,29.08 34.54,30.1 34.54,35.43 v34.29,35.69
  Bottom 0.762: v32.64,40.64 32.38,40.39 LCD_LIME2.26 | v32.38,49.4 LCD_LIME.26
  Bottom 1.016: 35.56,24.49 LCD_CON.26 35.56,29.08
LVDS0_VNC  (via drill 0.5, 0.6)
  Top 0.508: v36.83,35.69 36.83,37.57 35.05,39.34 35.05,40.64 v34.67,41.02 34.54,41.15 34.54,43.05 33.27,44.32 33.27,48.51 33.66,48.9 v33.66,49.4
  Bottom 0.254: LCD.17 23.66,8.35 | 23.66,8.35 23.66,8.47 23.37,8.76 23.37,8.59 23.61,8.35 23.66,8.35
  Bottom 0.508: 38.1,24.66 38.1,24.27 23.37,9.54 23.37,8.76 | 38.1,29.21 37.08,30.23 37.08,35.43 v36.83,35.69 | v34.67,41.02 34.42,41.02 33.66,40.26
  Bottom 0.762: 33.66,40.26 LCD_LIME2.28 | v33.66,49.4 LCD_LIME.28
  Bottom 1.016: 38.1,24.66 LCD_CON.28 38.1,29.21
LVDS0_VP0  (via drill 0.5, 0.6)
  Top 0.508: v30.48,35.69 30.48,35.94 29.59,36.83 29.59,41.4 29.34,41.66 v29.34,41.91
  Bottom 0.254: LCD.9 19.66,8.31 | 19.66,8.31 19.66,8.48 19.81,8.64 19.81,8.46 19.66,8.31
  Bottom 0.508: 30.48,30.35 31.5,29.34 31.5,23.86 19.81,12.18 19.81,8.64
  Bottom 0.762: LCD_LIME.21 29.84,45.97 30.1,45.72 30.1,44.45 29.84,44.2 LCD_LIME2.21 29.84,42.42 v29.34,41.91
  Bottom 1.016: 30.48,30.35 LCD_CON.21 v30.48,35.69
LVDS0_VP1  (via drill 0.5, 0.6)
  Top 0.508: v33.02,35.69 33.02,35.94 32.38,36.58 32.38,37.34 31.62,38.1 31.62,41.78 v31.37,42.04
  Bottom 0.254: LCD.12 21.16,8.56 21.21,8.61
  Bottom 0.508: 33.02,30.48 34.04,29.46 34.04,24.02 21.21,11.19 21.21,8.61
  Bottom 0.762: LCD_LIME.23 LCD_LIME2.23 31.11,42.29 v31.37,42.04
  Bottom 1.016: 33.02,30.48 LCD_CON.23 v33.02,35.69
LVDS0_VP2  (via drill 0.5, 0.6)
  Top 0.508: v35.56,35.69 35.56,35.94 34.92,36.58 34.92,37.72 33.66,38.99 33.66,41.27 v33.4,41.53
  Bottom 0.254: LCD.15 22.66,8.53 | 22.66,8.53 22.66,8.71 22.61,8.76 22.61,8.58 22.66,8.53
  Bottom 0.508: 35.56,30.61 36.58,29.59 36.58,24.22 22.61,10.25 22.61,8.76 | v33.4,41.53 32.38,42.55
  Bottom 0.762: LCD_LIME.25 LCD_LIME2.25 32.38,42.55
  Bottom 1.016: 35.56,30.61 LCD_CON.25 v35.56,35.69
LVDS0_VPC  (via drill 0.5, 0.6)
  Top 0.508: v38.1,35.69 38.1,35.81 37.47,36.45 37.47,37.85 35.69,39.62 35.69,41.66 v35.56,41.78
  Bottom 0.254: LCD.18 24.16,8.56 | 24.16,8.56 24.16,8.73 24,8.89 24,8.71 24.16,8.56
  Bottom 0.508: 38.1,30.61 39.12,29.59 39.12,24.38 24,9.27 24,8.89 | v35.56,41.78 35.31,42.04 34.29,42.04 33.66,42.67
  Bottom 0.762: LCD_LIME.27 LCD_LIME2.27 33.66,42.67
  Bottom 1.016: 38.1,30.61 LCD_CON.27 v38.1,35.69
N$1
  Bottom 0.762: 41.91,7.37 42.04,7.24 3.3V/5.0V.3
  Bottom 1.27: FET1.3 40.51,8.76 41.91,7.37
N$2
  Bottom 0.254: LCD.32 31.16,8.85 30.99,9.02 30.66,8.69 LCD.31 | LCD.33 31.66,8.73 31.37,9.02
  Bottom 1.016: FET3.3 30.9,11.13 30.99,11.05
  Bottom 1.524: 30.99,9.02 31.37,9.02 31.37,10.67 30.99,11.05
N$3
  Bottom 0.254: LCD.38 34.16,8.38 34.66,8.88 | LCD.40 35.16,8.65 34.8,9.02 34.66,8.88 | LCD.39 34.66,8.88
  Bottom 1.016: 36.45,10.54 36.58,10.67 PWR_JACK/10V_DCDC.2
  Bottom 1.27: 34.8,9.02 36.2,9.02 36.2,10.54 36.45,10.54
N$4
  Bottom 0.508: 32.38,15.37 BKL_E.1
  Bottom 1.016: 32.38,15.37 32.13,15.11 R12.2 32.13,13.35 FET3.1
N$5  (via drill 0.5, 0.6)
  Top 0.254: v19.68,48.36 19.68,46.86 16.89,44.07 16.89,40.39 14.35,37.85 13.46,37.85 12.7,37.08 v12.7,35.56
  Bottom 0.508: LCD_LIME.7 20.95,47.62 20.22,48.36 v19.68,48.36
  Bottom 0.762: LCD_LIME.7 LCD_LIME2.7
  Bottom 1.016: LCD_CON.7 v12.7,35.56
N$6  (via drill 0.6)
  Top 0.254: v21.97,48.13 21.97,46.86 19.68,44.58 19.68,40.01 v15.24,35.56
  Bottom 0.762: LCD_LIME2.9 LCD_LIME.9 22.23,47.88 v21.97,48.13
  Bottom 1.016: LCD_CON.9 v15.24,35.56
N$7  (via drill 0.6)
  Top 0.254: v20.32,35.56 20.32,35.94 21.72,37.34 21.72,43.69 25.53,47.5 v25.53,48.39
  Bottom 0.762: LCD_LIME2.13 LCD_LIME.13 24.77,47.62 v25.53,48.39
  Bottom 1.016: LCD_CON.13 v20.32,35.56
N$8
  Bottom 1.016: D1.1 40.19,17.53 41.59,16.13 42.16,16.13 43.69,14.61 R4.1 C4.2 43.69,11.32 FET2.1
N$9
  Bottom 1.016: FET1.1 39.56,12.25 38.48,13.34 C3.2 38.35,13.84 38.35,15.62 | 38.35,15.62 R3.1 | D1.2 38.35,17.7 38.35,15.62
N$10  (via drill 0.6)
  Top 0.254: v45.72,35.69 44.83,36.58 44.32,36.58 39.75,41.15 39.75,42.67 38.1,44.32 38.1,47.62 v37.59,48.13
  Bottom 0.762: LCD_LIME2.33 37.47,44.2 37.72,44.45 37.72,45.72 37.47,45.97 LCD_LIME.33 37.47,48.01 v37.59,48.13
  Bottom 1.016: LCD_CON.33 v45.72,35.69
N$11
  Bottom 1.016: T1.3 R5.1
N$12  (via drill 0.6)
  Top 0.254: v40.13,45.09 40.26,44.96 40.26,44.45 48.01,36.7 49.78,36.7 v50.8,35.69
  Bottom 0.762: LCD_LIME2.37 40.01,45.21 | 40.01,45.21 v40.13,45.09 | 40.01,45.21 LCD_LIME.37
  Bottom 1.016: v50.8,35.69 LCD_CON.37
N$13
  Bottom 0.254: 41.91,42.93 46.61,42.93 53.34,36.2
  Bottom 0.762: 41.91,42.93 41.27,42.93 LCD_LIME2.39 LCD_LIME.39
  Bottom 1.016: 53.34,36.2 LCD_CON.39
N$14  (via drill 0.6)
  Top 0.254: v13.84,36.96 14.61,36.96 18.67,41.02 18.67,45.09 20.57,46.99 20.57,49.28 v20.83,49.53
  Bottom 0.254: 20.95,38.35 20.57,37.97 14.86,37.97 v13.84,36.96 12.7,36.96 11.43,35.69 11.43,30.35 12.7,29.08
  Bottom 0.762: 20.95,38.35 LCD_LIME2.8 | v20.83,49.53 20.95,49.66 LCD_LIME.8
  Bottom 1.016: LCD_CON.8 12.7,29.08
N$15  (via drill 0.6)
  Top 0.254: v13.97,35.56 19.18,40.77 19.18,44.83 21.08,46.74 21.08,48.51 22.1,49.53 v22.23,49.53
  Bottom 0.254: 22.23,38.35 21.34,37.47 15.88,37.47 v13.97,35.56 13.97,30.35 15.24,29.08
  Bottom 0.762: 22.23,38.35 LCD_LIME2.10 | v22.23,49.53 LCD_LIME.10
  Bottom 1.016: LCD_CON.10 15.24,29.08
N$16  (via drill 0.6)
  Top 1.016: v44.96,4.19 44.96,9.65 44.32,10.29 v44.32,15.88
  Bottom 1.016: v44.32,15.88 44.2,16 44.2,17.64 T1.1 | EN/CTRL.2 44.2,3.43 v44.96,4.19
N$17  (via drill 0.6)
  Top 0.254: v19.05,35.56 21.21,37.72 21.21,43.81 24.64,47.24 24.64,49.4 v24.77,49.53
  Bottom 0.254: 24.77,38.35 22.86,36.45 19.94,36.45 v19.05,35.56 19.05,30.35 20.32,29.08
  Bottom 0.762: 24.77,38.35 LCD_LIME2.14 | v24.77,49.53 LCD_LIME.14
  Bottom 1.016: LCD_CON.14 20.32,29.08
N$18  (via drill 0.6)
  Top 0.254: v44.45,35.69 39.24,40.89 39.24,42.42 37.59,44.07 37.59,45.47 36.58,46.48 36.58,48.39 37.47,49.28 v37.47,49.4
  Bottom 0.254: 45.72,29.21 44.45,30.48 v44.45,35.69 43.18,36.96 39.62,36.96 38.99,37.59 38.35,37.59 37.47,38.48
  Bottom 0.762: v37.47,49.4 LCD_LIME.34 | 37.47,38.48 LCD_LIME2.34
  Bottom 1.016: LCD_CON.34 45.72,29.21
N$19
  Bottom 1.016: D1.3 39.41,20.07 39.75,20.07 41.27,21.59 R5.2
N$20  (via drill 0.6, 0.9)
  Top 1.016: 49.02,21.59 49.02,21.46 v49.4,21.46 v49.4,22.48
  Top 1.27: 49.02,21.59 49.02,28.57 44.32,33.27 7.62,33.27 7.24,33.66 | v6.22,34.67 7.24,33.66 | v6.22,34.67 v6.22,33.66 7.24,33.66 | 13.72,44.2 16,46.48 v16,46.74 | 13.72,44.2 v13.72,43.43 | v6.22,34.67 6.22,36.7 13.72,44.2
  Bottom 0.508: 16.76,43.43 LCD_LIME2.1 | 16.76,46.74 LCD_LIME.1
  Bottom 1.016: 5.08,33.66 5.08,34.67 v6.22,34.67 v6.22,33.66 5.08,33.66 | LCD_CON.1 5.08,33.66 | v49.4,21.46 49.4,21.97 | 49.4,21.97 49.02,21.97 | v49.4,22.48 49.4,21.97
  Bottom 1.27: v16,46.74 16.76,46.74 | v13.72,43.43 16.76,43.43
  Bottom 1.778: 49.02,21.97 PWR_JACK/5V_LCD_CON.3
N$21  (via drill 0.6)
  Top 0.254: v41.91,48.77 41.91,44.07 v48.01,37.97
  Bottom 0.254: 50.8,29.21 49.53,30.48 49.53,36.45 v48.01,37.97 40.51,37.97 40.01,38.48 | v41.91,48.77 41.15,49.53 40.51,49.53 40.01,50.04
  Bottom 0.762: 40.01,50.04 LCD_LIME.38 | 40.01,38.48 LCD_LIME2.38
  Bottom 1.016: 50.8,29.21 LCD_CON.38
N$22
  Bottom 1.778: PWR_JACK.1 49.91,14.1 49.91,15.49 50.29,15.11 | PWR_JACK/5V_LCD_CON.1 48.51,16.89 50.29,15.11 | 50.29,15.11 51.05,14.35
N$23  (via drill 0.6)
  Top 0.254: v49.02,38.86 47.88,38.86 42.8,43.94 v42.8,50.29
  Bottom 0.254: 53.34,29.21 52.07,30.48 52.07,35.81 v49.02,38.86 41.91,38.86
  Bottom 0.508: LCD_LIME2.40 41.27,38.86 41.53,38.86
  Bottom 0.762: v42.8,50.29 41.27,50.29 LCD_LIME.40 | 41.53,38.86 41.91,38.86
  Bottom 1.016: 53.34,29.21 LCD_CON.40
N$24  (via drill 0.6)
  Bottom 0.508: U1.5 3.94,10.41 3.94,9.91 3.94,9.65 3.94,9.46 U1.4
  Bottom 0.813: C7.1 3.05,9.91
  Bottom 1.016: 3.05,8.38 v3.43,8.38 3.94,8.38 | 3.05,8.38 C7.1 2.92,9.65 | 2.67,8.38 v2.41,8.38 v2.41,7.37 3.05,7.37 | 2.67,8.38 3.05,8.38 | 2.92,9.65 2.67,9.65 2.67,8.38 | 3.94,8.38 v4.45,8.38 v4.45,7.37 v3.43,7.37 3.05,7.37 | 2.92,9.65 3.94,9.65 3.94,8.38 | 3.05,7.37 R6.1 3.05,4.7
  Bottom 1.778: L1.2 3.05,16.46 C8.1 3.05,9.91 3.94,9.91
  other vias: 1.02,20.83 2.16,20.83 3.3,20.83
  pour Top (isolate 0.305): 3.94,22.23 0.51,22.23 0.51,6.73 4.95,6.73 4.95,9.02 3.94,9.02
  pour Bottom (isolate 0.305, no thermals): 0.51,22.23 4.06,22.23 4.06,13.59 0.51,13.59
N$123  (via drill 0.6)
  Bottom 0.508: U1.1 7.49,11.36 7.49,12.45
  Bottom 1.778: 7.49,12.45 7.49,16.33 L1.1 8.43,19.81 12.32,19.81 D2.2
  other vias: 6.22,11.56 6.22,12.57 8.51,12.83 8.51,13.84 7.11,20.83 8.26,20.83
  pour Top (isolate 0.305, no thermals): 6.6,22.23 6.6,13.34 6.22,12.95 5.84,12.95 5.84,11.05 10.41,11.05 10.41,22.23
  pour Bottom (isolate 0.305, no thermals): 10.54,21.84 10.54,21.08 14.35,21.08 14.35,17.14 10.54,17.14 10.54,11.18 5.84,11.18 5.84,13.08 6.35,13.08 6.6,13.34 6.6,21.84
N$126
  Bottom 0.508: U1.3 7.24,9.46 7.24,9.02 7.34,9.02 7.72,9.4
  Bottom 1.016: R11.1 R10.1 7.24,9.02
RXE0+  (via drill 0.5, 0.6)
  Top 0.508: v25.93,9.77 25.65,10.05 25.65,16.89 23.5,19.05 23.5,19.68 23.75,19.94 v23.75,20.07 | v22.86,35.56 22.86,36.04 24,37.19 24,43.31 v26.04,45.34
  Bottom 0.254: LCD.21 25.66,8.41 26.01,8.76
  Bottom 0.508: 26.01,8.76 26.01,9.69 v25.93,9.77 | v23.75,20.07 23.75,20.32 23.5,20.57 23.5,23.89 23.88,24.27 23.88,29.08 22.86,30.1
  Bottom 0.762: LCD_LIME.15 v26.04,45.34 LCD_LIME2.15
  Bottom 1.016: 22.86,30.1 LCD_CON.15 v22.86,35.56
RXE0-  (via drill 0.5, 0.6)
  Top 0.508: v25.09,9.02 25.02,9.09 25.02,16.62 22.86,18.78 22.86,19.68 22.61,19.94 v22.61,20.07 | v21.59,35.56 21.59,35.69 23.37,37.47 23.37,41.27 | v26.04,49.53 26.54,49.02 26.54,47.14 23.37,43.97 23.37,41.27 | 23.37,41.27 v22.99,41.27
  Bottom 0.254: LCD.20 25.16,8.64 25.15,8.64
  Bottom 0.508: v25.09,9.02 25.15,9.02 25.15,8.64 | v22.61,20.07 22.61,20.32 22.86,20.57 22.86,24.51 | 22.86,28.57 21.84,29.59 21.84,35.31 v21.59,35.56 | v22.99,41.27 23.24,41.27 23.62,40.89 25.4,40.89 26.04,40.26
  Bottom 0.762: 26.04,40.26 LCD_LIME2.16 | v26.04,49.53 LCD_LIME.16
  Bottom 1.016: 22.86,24.51 LCD_CON.16 22.86,28.57
RXE1+  (via drill 0.5, 0.6)
  Top 0.508: v28.07,11.81 27.8,12.08 27.8,18.95 26.04,20.71 26.04,21.72 26.29,21.97 v26.29,22.1 | v25.78,35.94 25.53,36.2 25.53,41.4 v25.91,41.78
  Bottom 0.254: LCD.24 27.16,8.63 27.3,8.78
  Bottom 0.508: 27.3,8.78 27.69,9.16 27.69,10.03 28.07,10.41 v28.07,11.81 | v26.29,22.1 26.16,22.23 26.16,22.48 26.04,22.61 26.04,23.89 26.42,24.27 26.42,29.21 25.4,30.23 | v25.91,41.78 26.54,41.78 27.3,42.55
  Bottom 0.762: LCD_LIME.17 LCD_LIME2.17 27.3,42.55
  Bottom 1.016: 25.4,30.23 LCD_CON.17 25.4,34.92 25.78,35.31 v25.78,35.94
RXE1-  (via drill 0.5, 0.6)
  Top 0.508: v27.15,11.06 27.15,18.69 25.4,20.45 25.4,21.72 25.15,21.97 v25.15,22.1 | v24.51,36.07 24.89,36.45 24.89,42.8 27.05,44.96 27.05,46.23 27.56,46.74 v27.56,48.39
  Bottom 0.254: LCD.23 26.66,8.86 | 26.66,8.86 26.8,8.99 26.8,9.14 | 26.79,9.16 26.8,9.16 26.8,9.14 | 26.66,8.86 26.66,9.14 26.8,9.14
  Bottom 0.508: 26.79,9.16 27.05,9.42 27.05,10.96 v27.15,11.06 | v25.15,22.1 25.15,22.35 25.4,22.61 25.4,24.51 | 25.4,28.7 24.38,29.72 24.38,35.94 v24.51,36.07 25.53,37.08 25.91,37.08 27.3,38.48 | v27.56,48.39 27.3,48.64 27.3,49.78
  Bottom 0.762: 27.3,38.48 LCD_LIME2.18 | 27.3,49.78 LCD_LIME.18
  Bottom 1.016: 25.4,24.51 LCD_CON.18 25.4,28.7
RXE2+  (via drill 0.5, 0.6)
  Top 0.508: v29.84,10.03 29.84,10.16 29.97,10.29 29.97,11.3 29.72,11.56 29.72,20.71 28.96,21.48 28.96,23.24 29.21,23.5 v29.21,23.88 | v27.94,35.69 27.94,37.08 27.56,37.47 27.56,43.28 28.57,44.3 28.57,44.7 v28.96,45.09
  Bottom 0.254: LCD.27 28.66,8.29 | 28.66,8.29 28.66,8.47 29.08,8.89 29.08,8.71 28.66,8.29
  Bottom 0.508: v29.84,10.03 29.84,9.91 29.08,9.14 29.08,8.89 | v29.21,23.88 29.21,24 28.96,24.26 28.96,29.34 27.94,30.35
  Bottom 0.762: 28.57,45.09 LCD_LIME.19 | v28.96,45.09 28.57,45.09 | 28.57,45.09 LCD_LIME2.19
  Bottom 1.016: 27.94,30.35 LCD_CON.19 v27.94,35.69
RXE2-  (via drill 0.5, 0.6)
  Top 0.508: v29.06,10.9 29.08,10.92 29.08,20.45 28.32,21.21 28.32,23.24 28.07,23.5 v28.07,23.88 | v26.92,36.58 26.92,43.56 27.94,44.58 27.94,45.47 28.57,46.1 v28.57,49.4
  Bottom 0.254: LCD.26 28.16,8.51 | 28.16,8.51 28.16,8.69 28.45,8.98 28.45,8.8 28.16,8.51
  Bottom 0.508: 28.45,8.98 28.45,9.53 28.93,10.01 28.93,10.77 v29.06,10.9 | 27.94,28.83 26.92,29.84 v26.92,36.58 28.57,38.23
  Bottom 0.762: LCD_CON.20 27.94,25.53 28.07,25.4 v28.07,23.88 | 28.57,38.23 LCD_LIME2.20 | v28.57,49.4 LCD_LIME.20
  Bottom 1.016: LCD_CON.20 27.94,28.83
RXEC+  (via drill 0.5, 0.6)
  Top 0.508: v30.25,6.1 30,6.35 28.96,6.35 28.7,6.1 28.69,6.1 27.8,5.21 25.65,5.21 24.13,6.73 24.13,14.49 21.08,17.54 21.08,18.17 21.34,18.43 v21.34,18.54 | v10.16,35.56 10.16,36.3 12.34,38.48 13.74,38.48 15.62,40.36 15.62,41.27 v16,41.66
  Bottom 0.254: LCD.30 30.16,6.19 v30.25,6.1 | v16,41.66 16.51,42.16 19.3,42.16 19.68,42.55
  Bottom 0.508: 10.16,30.48 11.18,29.46 11.18,24.62 11.8,24 20.19,24 21.08,23.11 21.08,19.05 21.34,18.8 v21.34,18.54
  Bottom 0.762: LCD_LIME.5 LCD_LIME2.5 19.68,42.55
  Bottom 1.016: 10.16,30.48 LCD_CON.5 v10.16,35.56
RXEC-  (via drill 0.5, 0.6)
  Top 0.508: v29.34,5.44 29.31,5.46 28.96,5.46 28.07,4.57 25.39,4.57 23.5,6.46 23.5,14.22 20.45,17.27 20.45,18.16 20.19,18.41 v20.19,18.54 | v19.56,49.53 19.3,49.53 18.67,48.9 18.67,46.74 14.99,43.05 14.99,40.77 | v8.89,35.56 8.89,35.94 12.06,39.12 13.46,39.12 14.99,40.64 14.99,40.77 | 14.99,40.77 v14.61,40.77
  Bottom 0.254: 29.34,6.3 29.66,6.62 29.66,6.69 | 29.66,6.69 LCD.29 | 29.66,6.69 29.34,6.37 29.34,6.22 | 19.68,40.26 19.3,40.64 14.73,40.64 v14.61,40.77
  Bottom 0.508: v29.34,5.44 29.34,6.22 29.34,6.3 | 10.16,24.74 11.53,23.37 19.93,23.37 20.45,22.85 20.45,19.05 20.19,18.8 v20.19,18.54 | 10.16,28.96 9.14,29.97 9.14,35.31 v8.89,35.56
  Bottom 0.762: 19.68,40.26 LCD_LIME2.6 | v19.56,49.53 19.68,49.66 LCD_LIME.6
  Bottom 1.016: 10.16,24.74 LCD_CON.6 10.16,28.96
VCC  (via drill 0.6, 0.8)
  Top 1.27: 32.13,2.92 35.56,2.92 41.66,9.02 v43.43,9.02 | 32.13,2.92 32.13,7.87 31.75,8.26 31.75,9.78 34.29,12.32 v34.29,15.62 | v19.56,14.48 19.56,7.87 24.51,2.92 32.13,2.92
  Bottom 0.254: LCD.2 16.16,8.79 16.26,8.89 | LCD.3 16.66,8.74 16.51,8.89 | LCD.4 17.16,8.37 16.64,8.89
  Bottom 0.508: 33.66,15.62 BKL_E.2 | FET2.3 44.53,9.02 43.94,9.02 | 44.58,7.24 3.3V/5.0V.1
  Bottom 1.016: v34.29,15.62 33.66,15.62 | 16.64,8.89 16.51,8.89 16.26,8.89 15.49,8.89 C2.1 C1.1 15.11,11.94 16.26,13.08 R7.1 R9.1 18.16,14.48 | R2.1 R1.2 18.16,16 18.16,14.48 | FET2.3 44.58,7.24 | 18.16,14.48 v19.56,14.48
  Bottom 1.27: 43.98,9.02 43.94,9.02 v43.43,9.02 v42.42,9.02
VLED_EN  (via drill 0.5, 0.6)
  Top 0.254: v18.92,3.68 17.78,4.83 17.27,4.83 15.75,6.35 15.75,10.67 17.14,12.06 v17.14,20.19 17.27,20.32 17.27,22.61 19.05,24.38 v19.05,25.27 | v23.75,48.26 23.75,47.12 20.7,44.07 20.7,38.48 v17.78,35.56
  Bottom 0.254: LCD.36 33.16,6.36 30.48,3.68 v18.92,3.68
  Bottom 0.508: v19.05,25.27 19.05,29.29 17.78,30.56
  Bottom 0.762: LCD_LIME2.11 LCD_LIME.11 23.5,48.01 v23.75,48.26
  Bottom 1.016: 17.78,30.56 LCD_CON.11 v17.78,35.56 | v17.14,20.19 17.14,19.05 R1.1
VPWM_EN  (via drill 0.6)
  Top 0.254: v17.4,3.94 17.27,3.94 15.24,5.97 15.24,10.92 15.88,11.56 v15.88,20.19 16.64,20.95 v16.64,25.27 | v23.5,49.53 22.86,48.9 22.86,46.99 20.19,44.32 20.19,39.24 v16.51,35.56
  Bottom 0.254: LCD.35 32.66,6.62 30.61,4.57 18.03,4.57 v17.4,3.94 | 17.78,29.08 16.51,30.35 v16.51,35.56 17.91,36.96 22.1,36.96 23.5,38.35
  Bottom 0.762: 23.5,38.35 LCD_LIME2.12 | v23.5,49.53 LCD_LIME.12
  Bottom 1.016: v16.64,25.27 17.78,25.27 LCD_CON.12 17.78,29.08 | v15.88,20.19 15.49,19.81 R2.2

### Text on the board
Top: Platkata trqbva da e debela 1mm!!!
Bottom: 60 errors
tNames: Platkata trqbva da e debela 1mm!!!
bNames: 39 | 1 | 2 | 5V_LCD_CON | https://www.olimex.com | PWR_JACK | A10-LCD15.6'' | 5V only | (C) 2014 | Rev.D